# Altium project HDsEMG V1.0.PrjPcb
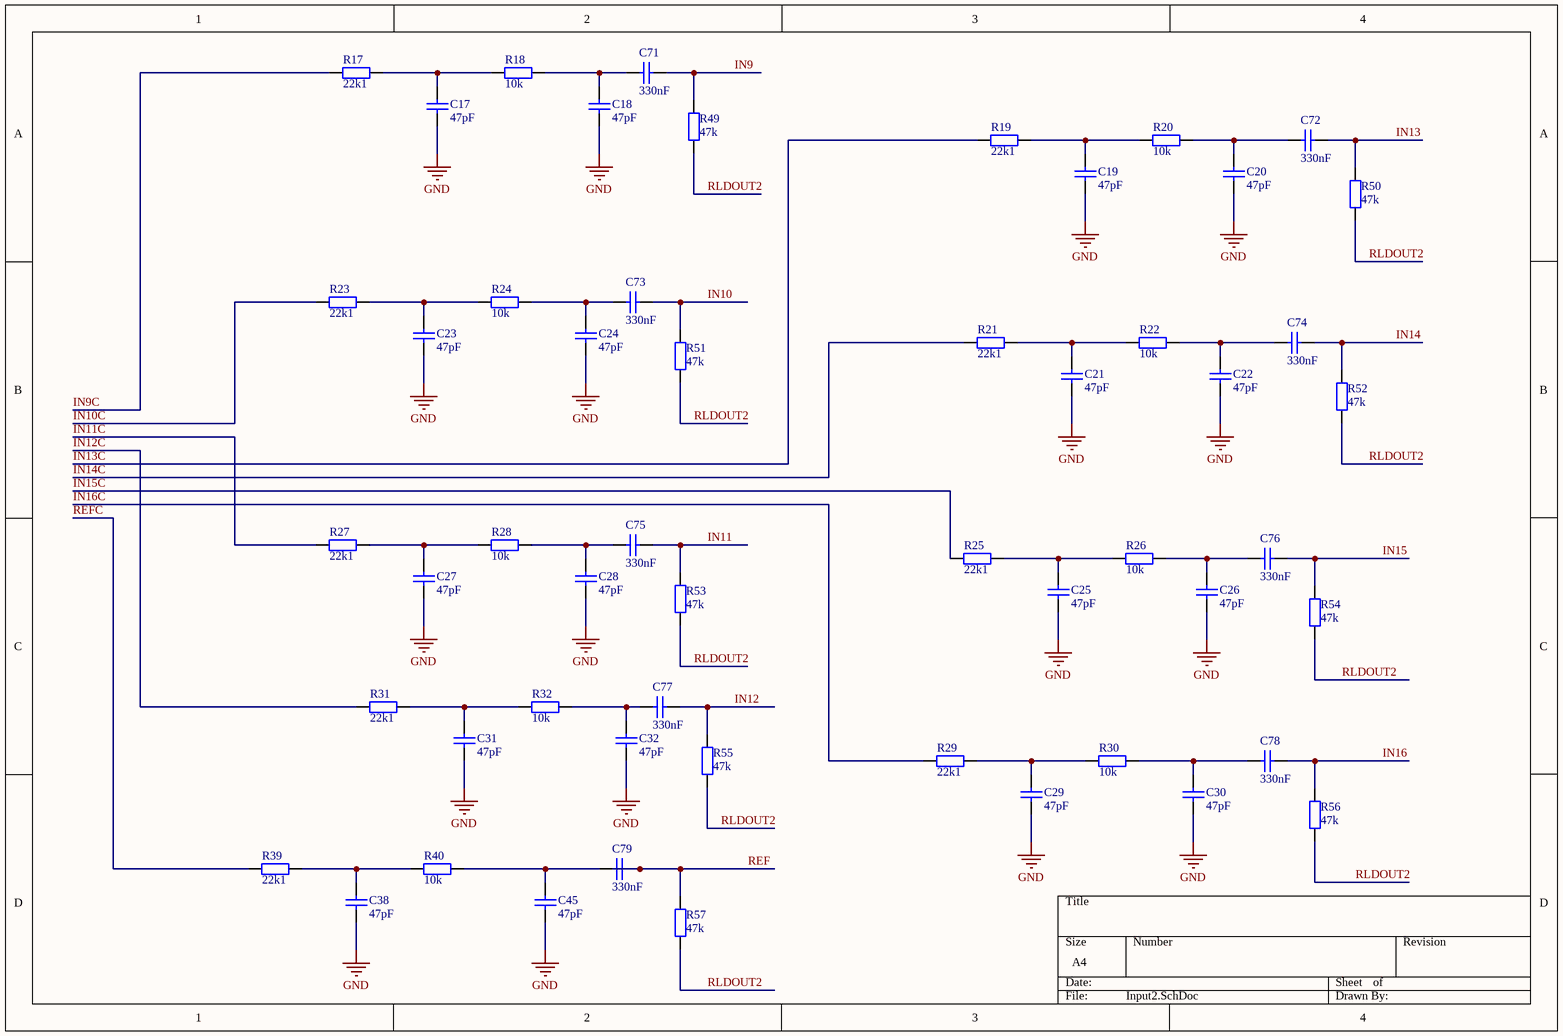
[diagram p0: Input2.SchDoc]
1 sheet, 54 parts. Net scope: global (net labels, ports and power ports of the same name join across sheets).
Board file: HDsEMG.PcbDoc

## Sheet Input2.SchDoc
size A4

### Parts
C17  47pF  [RESC1608X50N]
C18  47pF  [RESC1608X50N]
C19  47pF  [RESC1608X50N]
C20  47pF  [RESC1608X50N]
C21  47pF  [RESC1608X50N]
C22  47pF  [RESC1608X50N]
C23  47pF  [RESC1608X50N]
C24  47pF  [RESC1608X50N]
C25  47pF  [RESC1608X50N]
C26  47pF  [RESC1608X50N]
C27  47pF  [RESC1608X50N]
C28  47pF  [RESC1608X50N]
C29  47pF  [RESC1608X50N]
C30  47pF  [RESC1608X50N]
C31  47pF  [RESC1608X50N]
C32  47pF  [RESC1608X50N]
C38  47pF  [RESC1608X50N]
C45  47pF  [RESC1608X50N]
C71  330nF  [RESC1608X50N]
C72  330nF  [RESC1608X50N]
C73  330nF  [RESC1608X50N]
C74  330nF  [RESC1608X50N]
C75  330nF  [RESC1608X50N]
C76  330nF  [RESC1608X50N]
C77  330nF  [RESC1608X50N]
C78  330nF  [RESC1608X50N]
C79  330nF  [RESC1608X50N]
R17  22k1  [CAPC1608X90]
R18  10k  [CAPC1608X90]
R19  22k1  [CAPC1608X90]
R20  10k  [CAPC1608X90]
R21  22k1  [CAPC1608X90]
R22  10k  [CAPC1608X90]
R23  22k1  [CAPC1608X90]
R24  10k  [CAPC1608X90]
R25  22k1  [CAPC1608X90]
R26  10k  [CAPC1608X90]
R27  22k1  [CAPC1608X90]
R28  10k  [CAPC1608X90]
R29  22k1  [CAPC1608X90]
R30  10k  [CAPC1608X90]
R31  22k1  [CAPC1608X90]
R32  10k  [CAPC1608X90]
R39  22k1  [CAPC1608X90]
R40  10k  [CAPC1608X90]
R49  47k  [CAPC1608X90]
R50  47k  [CAPC1608X90]
R51  47k  [CAPC1608X90]
R52  47k  [CAPC1608X90]
R53  47k  [CAPC1608X90]
R54  47k  [CAPC1608X90]
R55  47k  [CAPC1608X90]
R56  47k  [CAPC1608X90]
R57  47k  [CAPC1608X90]

### Nets
GND: C17.1 C18.1 C19.1 C20.1 C21.1 C22.1 C23.1 C24.1 C25.1 C26.1 C27.1 C28.1 C29.1 C30.1 C31.1 C32.1 C38.1 C45.1
IN9: C71.1 R49.2
IN9C: R17.1
IN10: C73.1 R51.2
IN10C: R23.1
IN11: C75.1 R53.2
IN11C: R27.1
IN12: C77.1 R55.2
IN12C: R31.1
IN13: C72.1 R50.2
IN13C: R19.1
IN14: C74.1 R52.2
IN14C: R21.1
IN15: C76.1 R54.2
IN15C: R25.1
IN16: C78.1 R56.2
IN16C: R29.1
REF: C79.1 R57.2
REFC: R39.1
RLDOUT2: R49.1 R50.1 R51.1 R52.1 R53.1 R54.1 R55.1 R56.1 R57.1
NetC17_2: C17.2 R17.2 R18.1
NetC18_2: C18.2 C71.2 R18.2
NetC19_2: C19.2 R19.2 R20.1
NetC20_2: C20.2 C72.2 R20.2
NetC21_2: C21.2 R21.2 R22.1
NetC22_2: C22.2 C74.2 R22.2
NetC23_2: C23.2 R23.2 R24.1
NetC24_2: C24.2 C73.2 R24.2
NetC25_2: C25.2 R25.2 R26.1
NetC26_2: C26.2 C76.2 R26.2
NetC27_2: C27.2 R27.2 R28.1
NetC28_2: C28.2 C75.2 R28.2
NetC29_2: C29.2 R29.2 R30.1
NetC30_2: C30.2 C78.2 R30.2
NetC31_2: C31.2 R31.2 R32.1
NetC32_2: C32.2 C77.2 R32.2
NetC38_2: C38.2 R39.2 R40.1
NetC45_2: C45.2 C79.2 R40.2

### Library data of the parts
C17-C32 C38 C45 C71-C79 = Cap: Capacitor; Value: 100pF; Published: 8-Jun-2000; LatestRevisionDate: 17-Jul-2002; LatestRevisionNote: Re-released for DXP Platform.; PackageReference: RAD-0.3; Publisher: Altium Limited; PackageDescription: Radial Cap, Thru-Hole; 2 Leads; 0.3 in Pin Spacing
R17-R32 R39 R40 R49-R57 = Res2: Resistor; Value: 1K; Published: 8-Jun-2000; LatestRevisionDate: 17-Jul-2002; LatestRevisionNote: Re-released for DXP Platform.; PackageReference: AXIAL-0.4; Publisher: Altium Limited; PackageDescription: Axial Device, Thru-Hole; 2 Leads; 0.4 in Pin Spacing